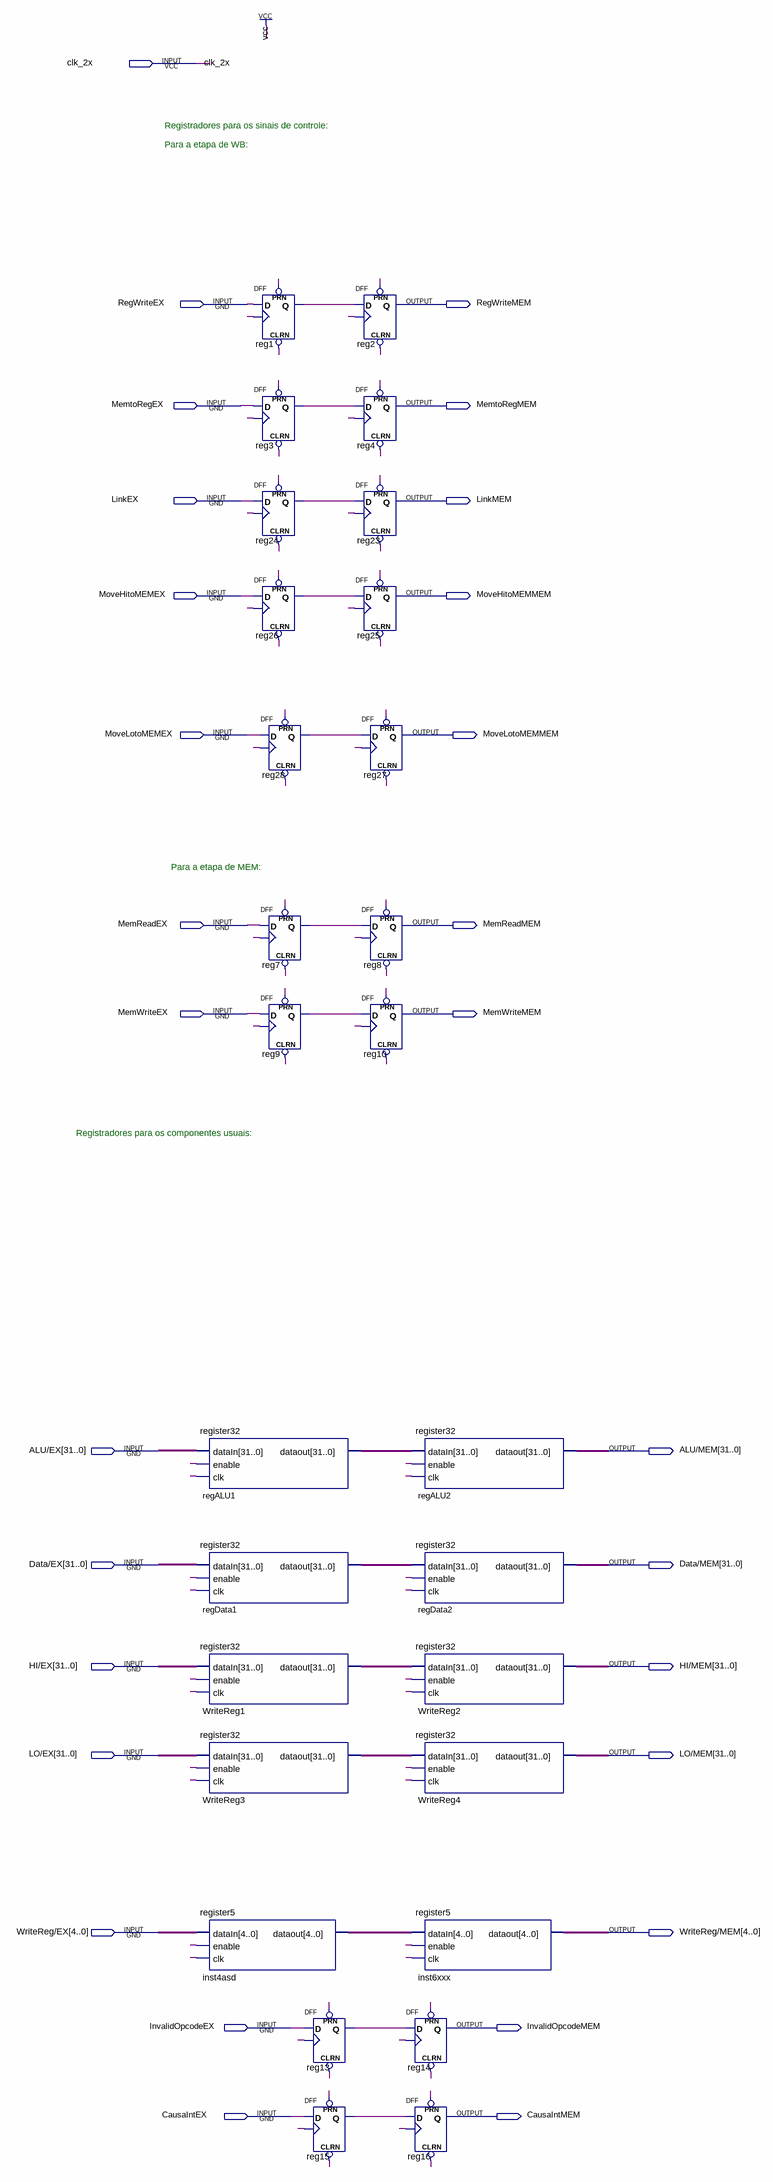
[diagram p0: schematic sheet]
// Quartus schematic registerEXMEM.bdf as structural Verilog: 28 symbols, 29 pins
module registerEXMEM (
  input  clk_2x,
  input  RegWriteEX,
  input  MemtoRegEX,
  input  LinkEX,
  input  MoveHitoMEMEX,
  input  MoveLotoMEMEX,
  input  MemReadEX,
  input  MemWriteEX,
  input  [31:0] \ALU/EX ,
  input  [31:0] \Data/EX ,
  input  [31:0] \HI/EX ,
  input  [31:0] \LO/EX ,
  input  [4:0] \WriteReg/EX ,
  input  InvalidOpcodeEX,
  input  CausaIntEX,
  output RegWriteMEM,
  output MemtoRegMEM,
  output LinkMEM,
  output MoveHitoMEMMEM,
  output MoveLotoMEMMEM,
  output MemReadMEM,
  output MemWriteMEM,
  output [31:0] \ALU/MEM ,
  output [31:0] \Data/MEM ,
  output [31:0] \HI/MEM ,
  output [31:0] \LO/MEM ,
  output [4:0] \WriteReg/MEM ,
  output InvalidOpcodeMEM,
  output CausaIntMEM
);

  wire reg1_q, reg3_q, reg7_q, reg9_q, reg13_q, reg15_q, reg24_q, reg26_q, reg28_q;
  wire [4:0] inst4asd_dataout;
  wire [31:0] regALU1_dataout, regData1_dataout, WriteReg1_dataout, WriteReg3_dataout;

  register32 regALU1 (.dataIn(\ALU/EX ), .enable(1'b1), .clk(clk_2x), .dataout(regALU1_dataout));
  register32 regData1 (.dataIn(\Data/EX ), .enable(1'b1), .clk(clk_2x), .dataout(regData1_dataout));
  register32 WriteReg1 (.dataIn(\HI/EX ), .enable(1'b1), .clk(clk_2x), .dataout(WriteReg1_dataout));
  register32 WriteReg3 (.dataIn(\LO/EX ), .enable(1'b1), .clk(clk_2x), .dataout(WriteReg3_dataout));
  register5 inst4asd (.dataIn(\WriteReg/EX ), .enable(1'b1), .clk(clk_2x), .dataout(inst4asd_dataout));
  DFF reg1 (.CLRN(1'b1), .CLK(clk_2x), .D(RegWriteEX), .PRN(1'b1), .Q(reg1_q));
  DFF reg3 (.CLRN(1'b1), .CLK(clk_2x), .D(MemtoRegEX), .PRN(1'b1), .Q(reg3_q));
  DFF reg24 (.CLRN(1'b1), .CLK(clk_2x), .D(LinkEX), .PRN(1'b1), .Q(reg24_q));
  DFF reg26 (.CLRN(1'b1), .CLK(clk_2x), .D(MoveHitoMEMEX), .PRN(1'b1), .Q(reg26_q));
  DFF reg28 (.CLRN(1'b1), .CLK(clk_2x), .D(MoveLotoMEMEX), .PRN(1'b1), .Q(reg28_q));
  DFF reg7 (.CLRN(1'b1), .CLK(clk_2x), .D(MemReadEX), .PRN(1'b1), .Q(reg7_q));
  DFF reg9 (.CLRN(1'b1), .CLK(clk_2x), .D(MemWriteEX), .PRN(1'b1), .Q(reg9_q));
  DFF reg13 (.CLRN(1'b1), .CLK(clk_2x), .D(InvalidOpcodeEX), .PRN(1'b1), .Q(reg13_q));
  DFF reg15 (.CLRN(1'b1), .CLK(clk_2x), .D(CausaIntEX), .PRN(1'b1), .Q(reg15_q));
  DFF reg2 (.CLRN(1'b1), .CLK(clk_2x), .D(reg1_q), .PRN(1'b1), .Q(RegWriteMEM));
  DFF reg4 (.CLRN(1'b1), .CLK(clk_2x), .D(reg3_q), .PRN(1'b1), .Q(MemtoRegMEM));
  DFF reg23 (.CLRN(1'b1), .CLK(clk_2x), .D(reg24_q), .PRN(1'b1), .Q(LinkMEM));
  DFF reg25 (.CLRN(1'b1), .CLK(clk_2x), .D(reg26_q), .PRN(1'b1), .Q(MoveHitoMEMMEM));
  DFF reg27 (.CLRN(1'b1), .CLK(clk_2x), .D(reg28_q), .PRN(1'b1), .Q(MoveLotoMEMMEM));
  DFF reg8 (.CLRN(1'b1), .CLK(clk_2x), .D(reg7_q), .PRN(1'b1), .Q(MemReadMEM));
  DFF reg10 (.CLRN(1'b1), .CLK(clk_2x), .D(reg9_q), .PRN(1'b1), .Q(MemWriteMEM));
  DFF reg14 (.CLRN(1'b1), .CLK(clk_2x), .D(reg13_q), .PRN(1'b1), .Q(InvalidOpcodeMEM));
  DFF reg16 (.CLRN(1'b1), .CLK(clk_2x), .D(reg15_q), .PRN(1'b1), .Q(CausaIntMEM));
  register32 regALU2 (.dataIn(regALU1_dataout), .enable(1'b1), .clk(clk_2x), .dataout(\ALU/MEM ));
  register32 regData2 (.dataIn(regData1_dataout), .enable(1'b1), .clk(clk_2x), .dataout(\Data/MEM ));
  register32 WriteReg2 (.dataIn(WriteReg1_dataout), .enable(1'b1), .clk(clk_2x), .dataout(\HI/MEM ));
  register32 WriteReg4 (.dataIn(WriteReg3_dataout), .enable(1'b1), .clk(clk_2x), .dataout(\LO/MEM ));
  register5 inst6xxx (.dataIn(inst4asd_dataout), .enable(1'b1), .clk(clk_2x), .dataout(\WriteReg/MEM ));

  // Notes on the sheet:
  //   Registradores para os sinais de controle:
  //   Para a etapa de WB:
  //   Para a etapa de MEM:
  //   Registradores para os componentes usuais:
endmodule
